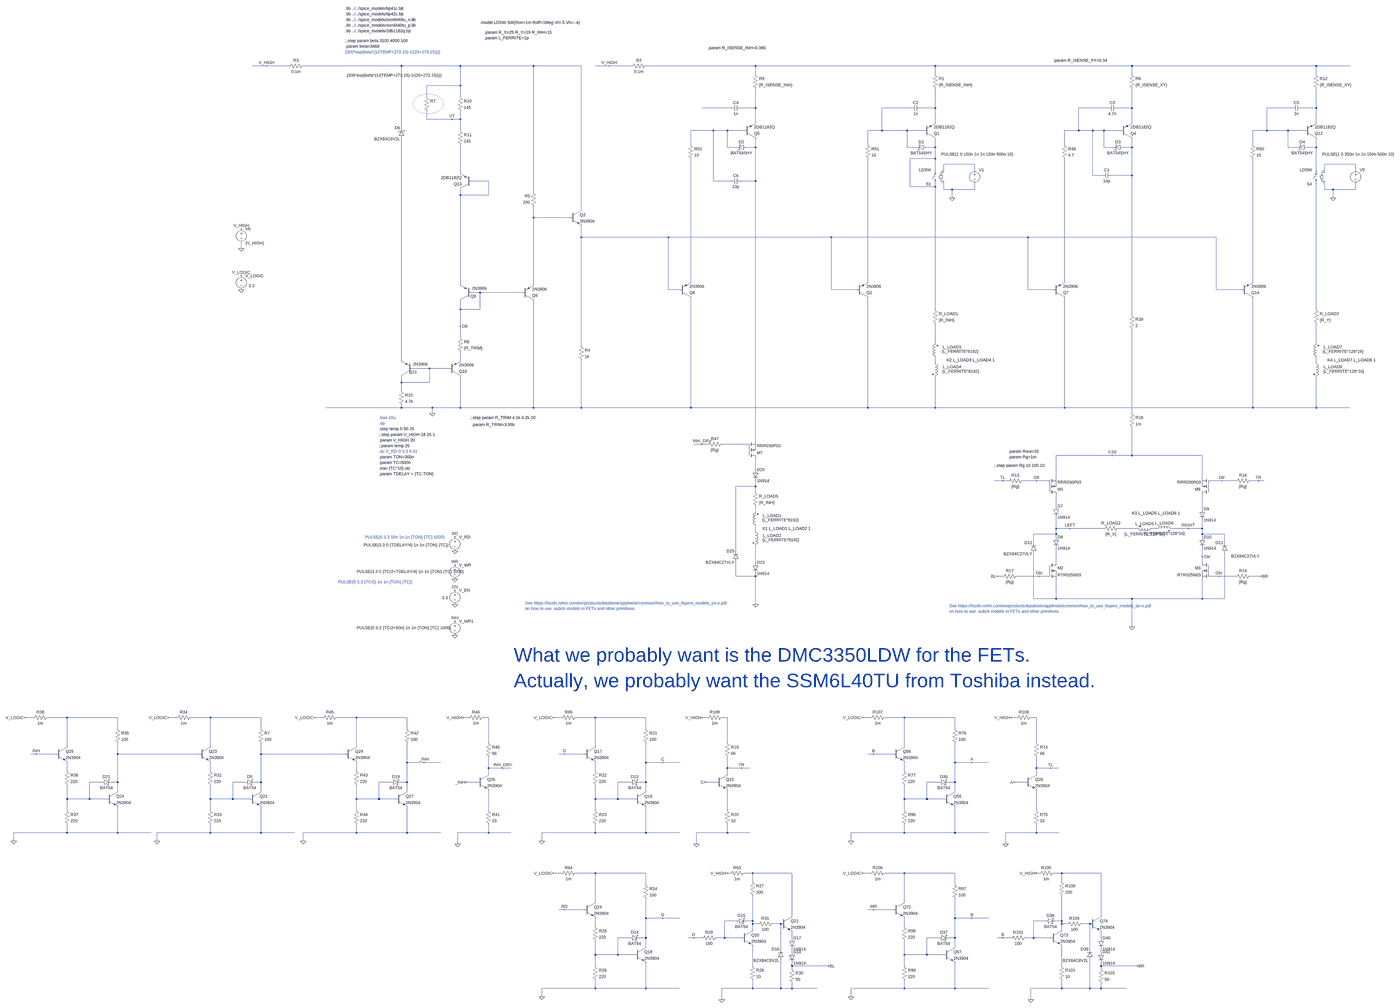
[diagram p0: schematic line_switch_new3.asc, whole sheet]
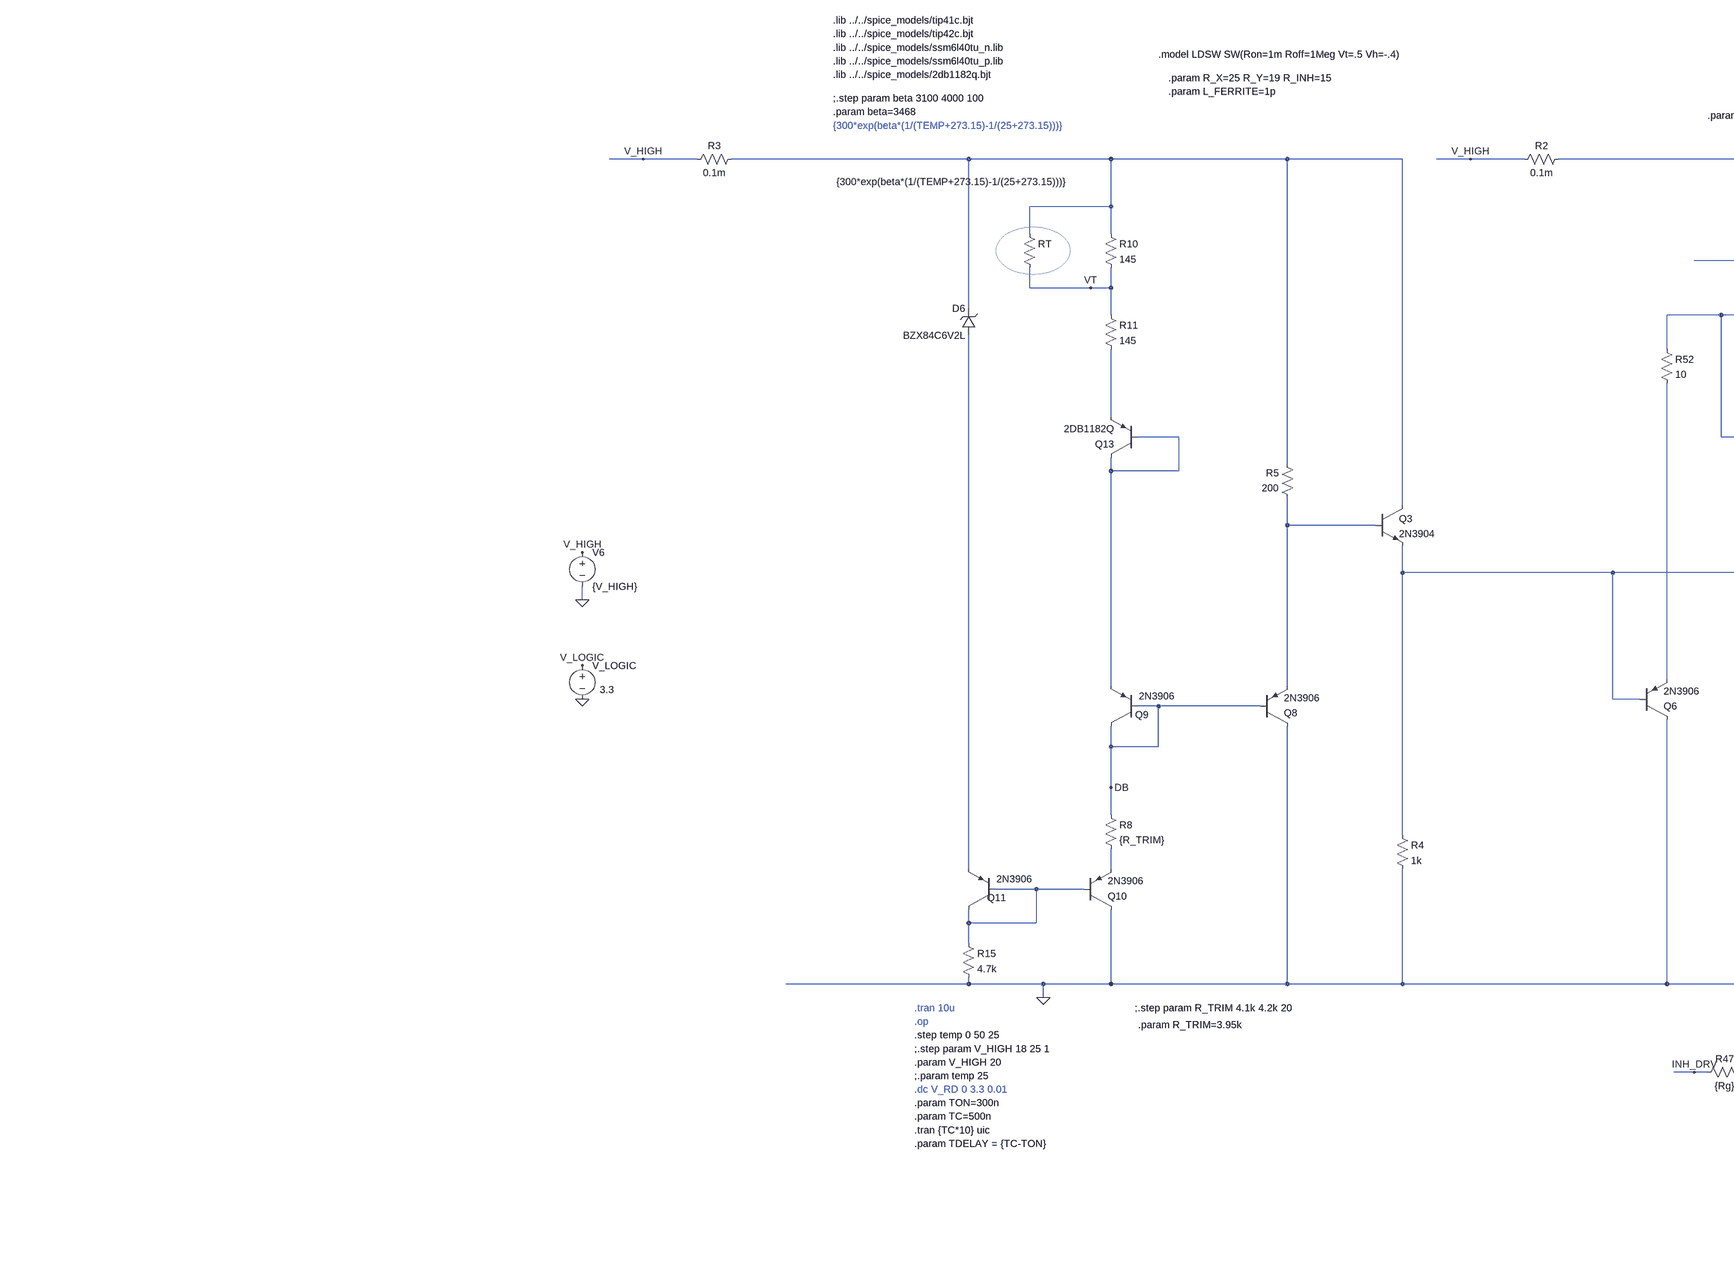
[diagram p1: schematic line_switch_new3.asc, part, row 1 of 2, column 1 of 2]
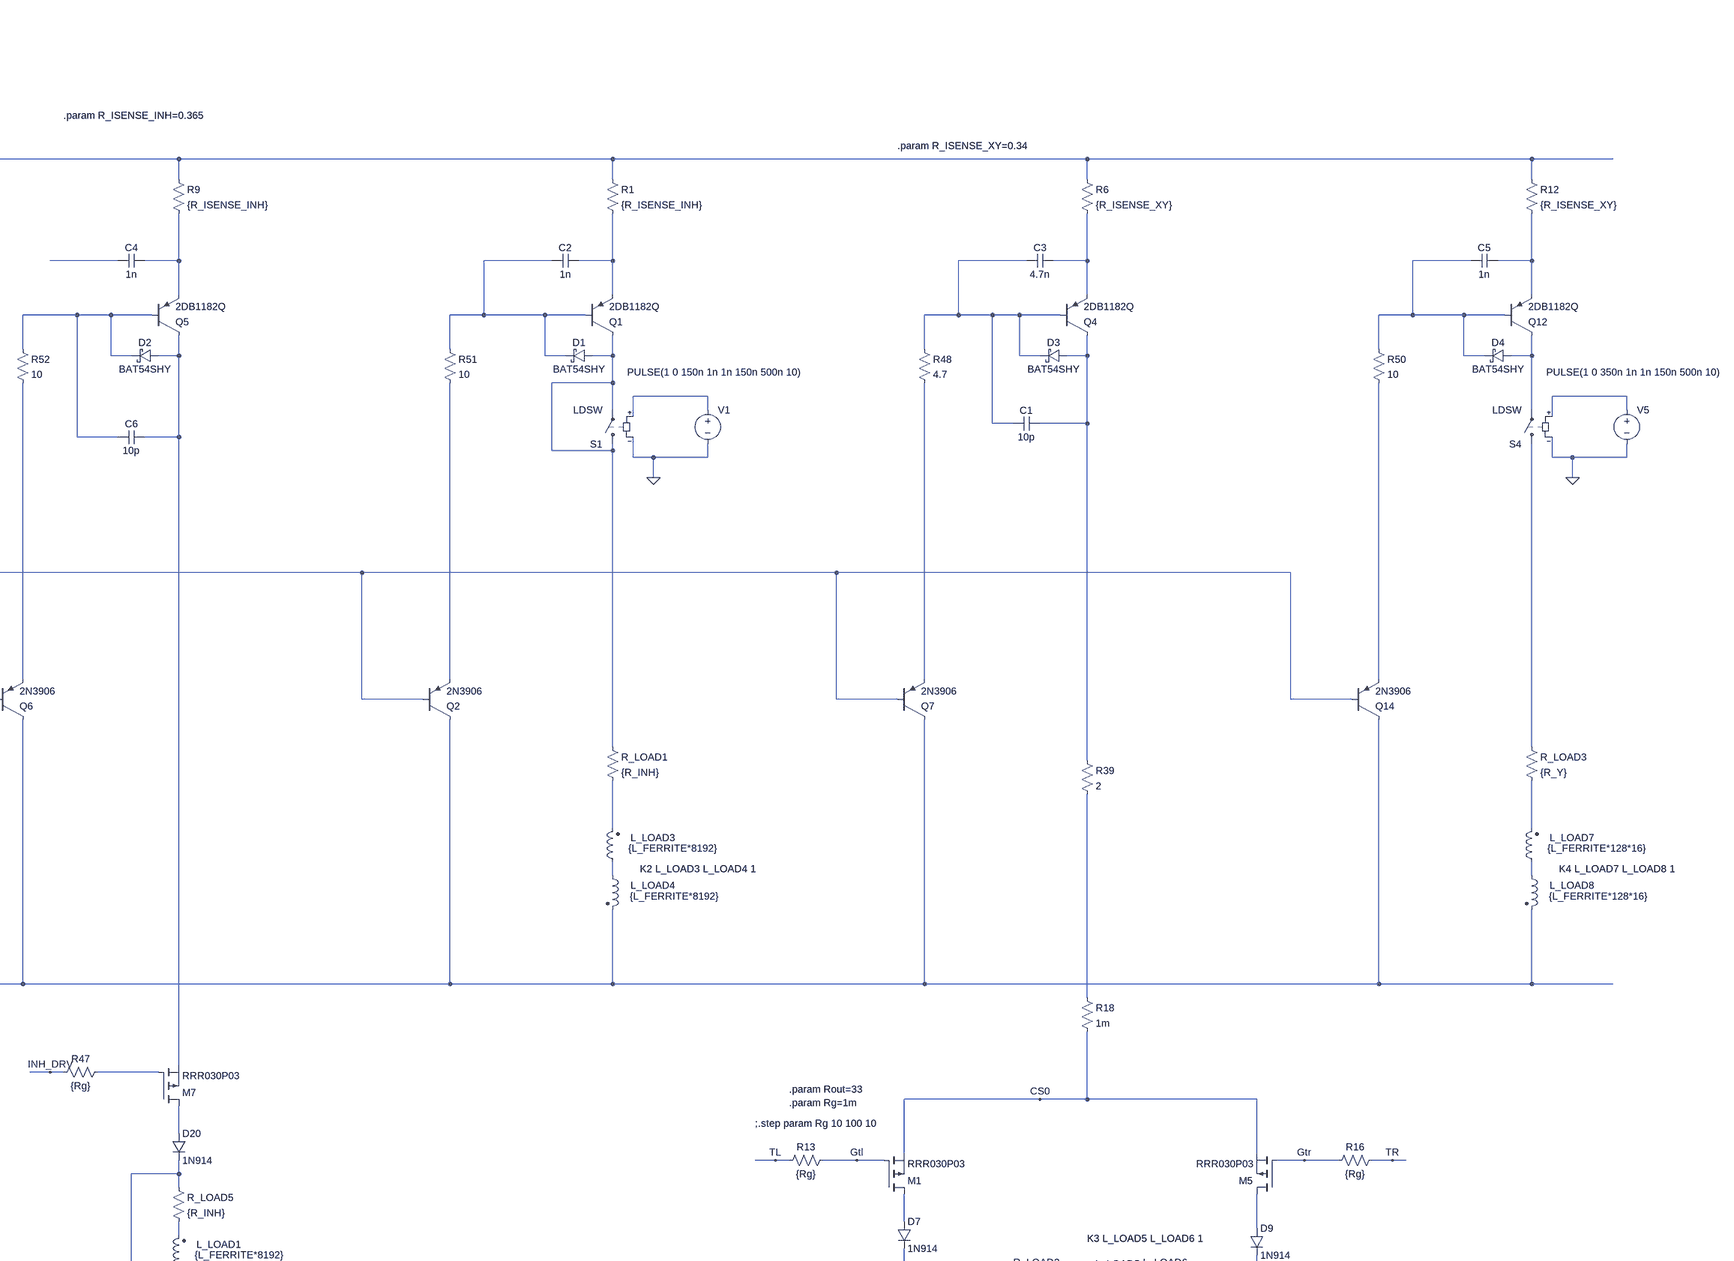
[diagram p2: schematic line_switch_new3.asc, part, row 1 of 2, column 2 of 2]
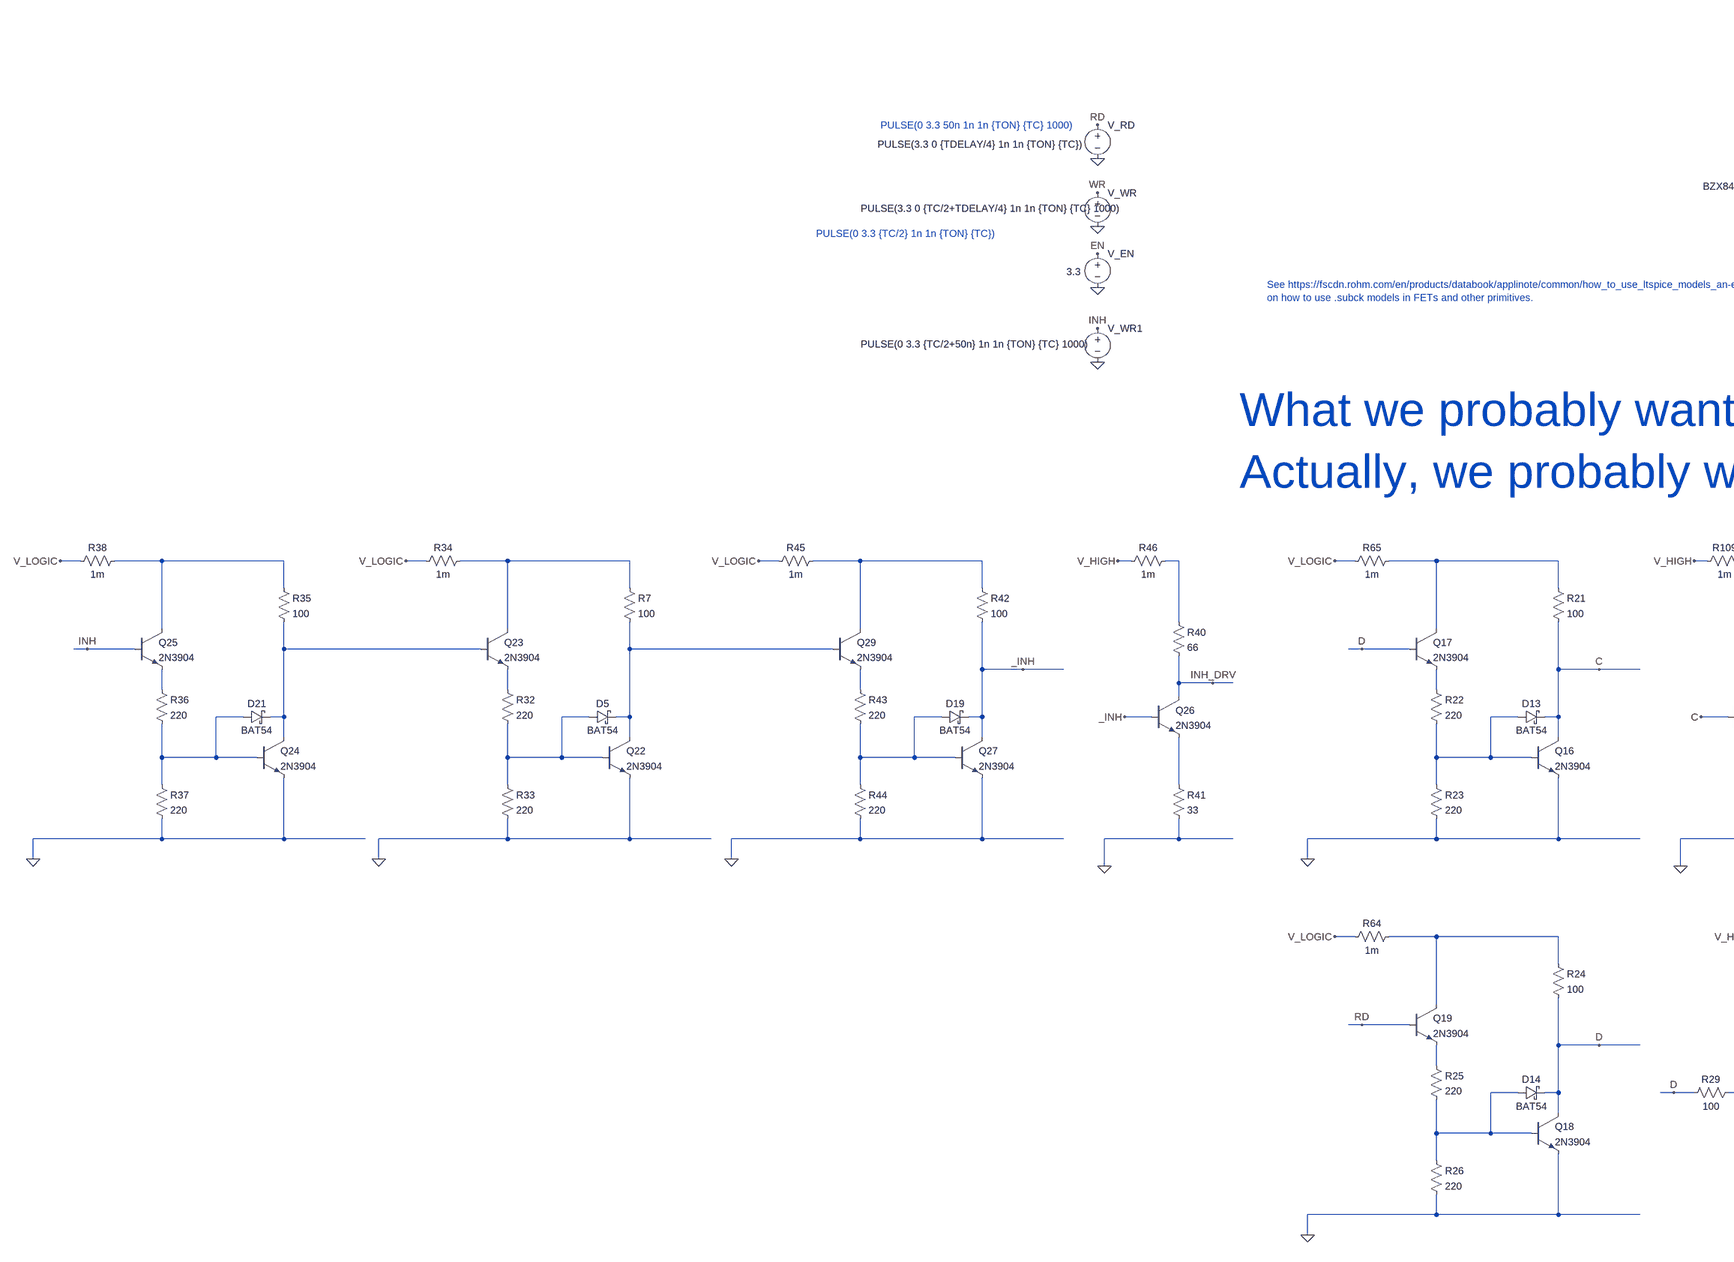
[diagram p3: schematic line_switch_new3.asc, part, row 2 of 2, column 1 of 2]
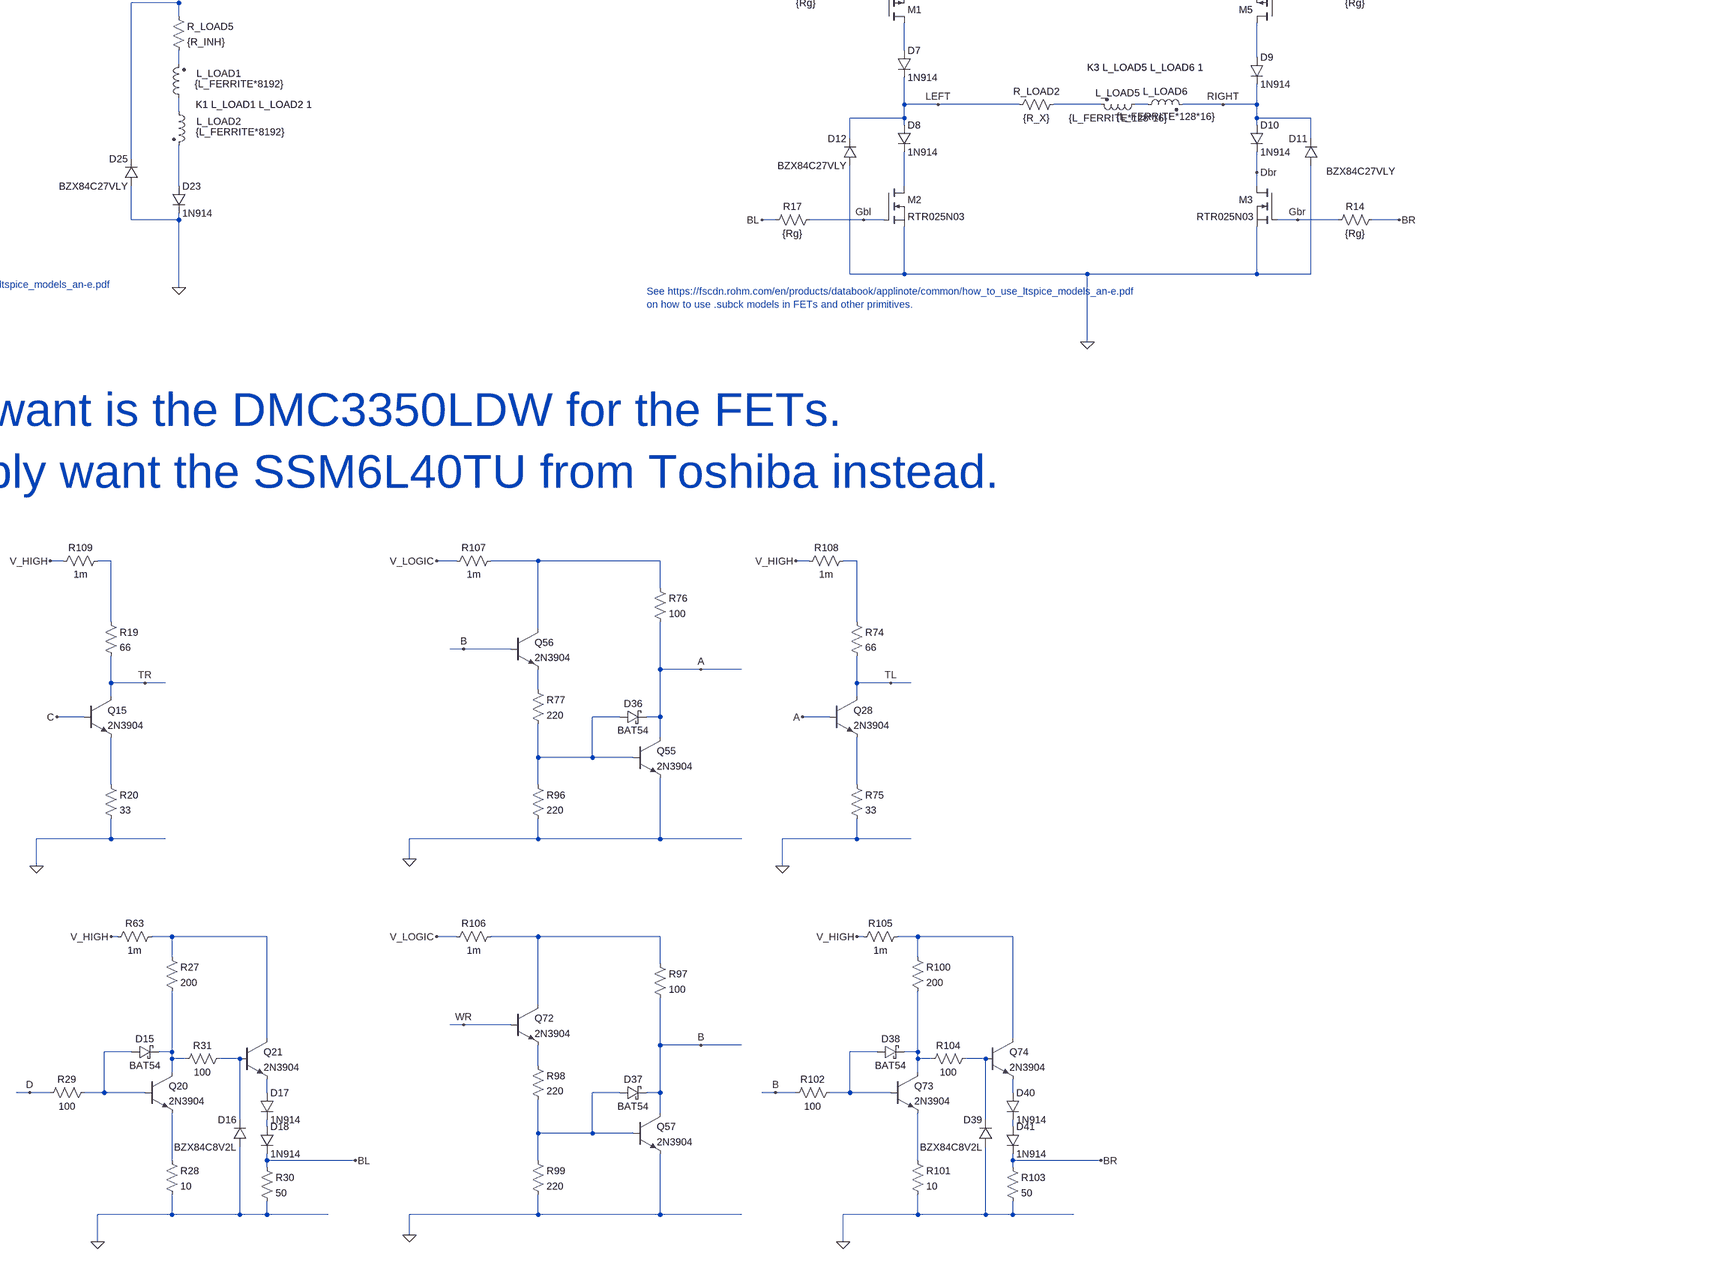
[diagram p4: schematic line_switch_new3.asc, part, row 2 of 2, column 2 of 2]
line_switch_new3.asc, the LTspice schematic file:
Version 4
SHEET 1 14296 5700
WIRE -1088 -3552 -1168 -3552
WIRE -960 -3552 -1088 -3552
WIRE -320 -3552 -880 -3552
WIRE 16 -3552 -320 -3552
WIRE 432 -3552 16 -3552
WIRE 704 -3552 432 -3552
WIRE 864 -3552 784 -3552
WIRE 992 -3552 864 -3552
WIRE 1696 -3552 1072 -3552
WIRE 2720 -3552 1696 -3552
WIRE 3840 -3552 2720 -3552
WIRE 4912 -3552 3840 -3552
WIRE 5104 -3552 4912 -3552
WIRE 1696 -3504 1696 -3552
WIRE 2720 -3504 2720 -3552
WIRE 3840 -3504 3840 -3552
WIRE 4912 -3504 4912 -3552
WIRE 16 -3440 16 -3552
WIRE 16 -3440 -176 -3440
WIRE -176 -3376 -176 -3440
WIRE 16 -3376 16 -3440
WIRE 1552 -3312 1392 -3312
WIRE 1696 -3312 1696 -3424
WIRE 1696 -3312 1616 -3312
WIRE 2576 -3312 2416 -3312
WIRE 2720 -3312 2720 -3424
WIRE 2720 -3312 2640 -3312
WIRE 3696 -3312 3536 -3312
WIRE 3840 -3312 3840 -3424
WIRE 3840 -3312 3760 -3312
WIRE 4768 -3312 4608 -3312
WIRE 4912 -3312 4912 -3424
WIRE 4912 -3312 4832 -3312
WIRE -176 -3248 -176 -3296
WIRE -32 -3248 -176 -3248
WIRE 16 -3248 16 -3296
WIRE 16 -3248 -32 -3248
WIRE 1696 -3232 1696 -3312
WIRE 2720 -3232 2720 -3312
WIRE 3840 -3232 3840 -3312
WIRE 4912 -3232 4912 -3312
WIRE -320 -3200 -320 -3552
WIRE 16 -3184 16 -3248
WIRE 1456 -3184 1328 -3184
WIRE 1536 -3184 1456 -3184
WIRE 1632 -3184 1536 -3184
WIRE 2416 -3184 2416 -3312
WIRE 2416 -3184 2336 -3184
WIRE 2560 -3184 2416 -3184
WIRE 2656 -3184 2560 -3184
WIRE 3536 -3184 3536 -3312
WIRE 3536 -3184 3456 -3184
WIRE 3616 -3184 3536 -3184
WIRE 3680 -3184 3616 -3184
WIRE 3776 -3184 3680 -3184
WIRE 4608 -3184 4608 -3312
WIRE 4608 -3184 4528 -3184
WIRE 4752 -3184 4608 -3184
WIRE 4848 -3184 4752 -3184
WIRE 1328 -3104 1328 -3184
WIRE 2336 -3104 2336 -3184
WIRE 3456 -3104 3456 -3184
WIRE 4528 -3104 4528 -3184
WIRE 1536 -3088 1536 -3184
WIRE 1584 -3088 1536 -3088
WIRE 1696 -3088 1696 -3136
WIRE 1696 -3088 1648 -3088
WIRE 2560 -3088 2560 -3184
WIRE 2608 -3088 2560 -3088
WIRE 2720 -3088 2720 -3136
WIRE 2720 -3088 2672 -3088
WIRE 3680 -3088 3680 -3184
WIRE 3728 -3088 3680 -3088
WIRE 3840 -3088 3840 -3136
WIRE 3840 -3088 3792 -3088
WIRE 4752 -3088 4752 -3184
WIRE 4800 -3088 4752 -3088
WIRE 4912 -3088 4912 -3136
WIRE 4912 -3088 4864 -3088
WIRE 2720 -3024 2720 -3088
WIRE 2720 -3024 2576 -3024
WIRE 2944 -2992 2768 -2992
WIRE 5136 -2992 4960 -2992
WIRE 2720 -2960 2720 -3024
WIRE 2944 -2960 2944 -2992
WIRE 4912 -2960 4912 -3088
WIRE 5136 -2960 5136 -2992
WIRE 16 -2944 16 -3104
WIRE 2768 -2944 2768 -2992
WIRE 4960 -2944 4960 -2992
WIRE 3616 -2928 3616 -3184
WIRE 3664 -2928 3616 -2928
WIRE 3840 -2928 3840 -3088
WIRE 3840 -2928 3728 -2928
WIRE 176 -2896 80 -2896
WIRE 1456 -2896 1456 -3184
WIRE 1552 -2896 1456 -2896
WIRE 1696 -2896 1696 -3088
WIRE 1696 -2896 1616 -2896
WIRE 2576 -2864 2576 -3024
WIRE 2720 -2864 2720 -2880
WIRE 2720 -2864 2576 -2864
WIRE 2768 -2848 2768 -2896
WIRE 2816 -2848 2768 -2848
WIRE 2944 -2848 2944 -2880
WIRE 2944 -2848 2816 -2848
WIRE 4960 -2848 4960 -2896
WIRE 5008 -2848 4960 -2848
WIRE 5136 -2848 5136 -2880
WIRE 5136 -2848 5008 -2848
WIRE 432 -2832 432 -3552
WIRE 16 -2816 16 -2848
WIRE 176 -2816 176 -2896
WIRE 176 -2816 16 -2816
WIRE 2816 -2800 2816 -2848
WIRE 5008 -2800 5008 -2848
WIRE 704 -2736 704 -3552
WIRE 432 -2688 432 -2752
WIRE 640 -2688 432 -2688
WIRE 704 -2576 704 -2640
WIRE 1200 -2576 704 -2576
WIRE 2128 -2576 1200 -2576
WIRE 3248 -2576 2128 -2576
WIRE 4320 -2576 3248 -2576
WIRE -1232 -2512 -1232 -2544
WIRE 1328 -2304 1328 -3024
WIRE 2336 -2304 2336 -3024
WIRE 3456 -2304 3456 -3024
WIRE 4528 -2304 4528 -3024
WIRE 16 -2288 16 -2816
WIRE 432 -2288 432 -2688
WIRE 1200 -2256 1200 -2576
WIRE 1264 -2256 1200 -2256
WIRE 2128 -2256 2128 -2576
WIRE 2272 -2256 2128 -2256
WIRE 3248 -2256 3248 -2576
WIRE 3392 -2256 3248 -2256
WIRE 4320 -2256 4320 -2576
WIRE 4464 -2256 4320 -2256
WIRE 128 -2240 80 -2240
WIRE 368 -2240 128 -2240
WIRE 16 -2144 16 -2192
WIRE 128 -2144 128 -2240
WIRE 128 -2144 16 -2144
WIRE 2720 -2144 2720 -2864
WIRE 4912 -2144 4912 -2880
WIRE 3840 -2112 3840 -2928
WIRE 16 -2048 16 -2144
WIRE 16 -1984 16 -2048
WIRE 2720 -1952 2720 -2064
WIRE 4912 -1952 4912 -2064
WIRE 704 -1936 704 -2576
WIRE -320 -1856 -320 -3136
WIRE 16 -1856 16 -1904
WIRE 2720 -1840 2720 -1872
WIRE 4912 -1840 4912 -1872
WIRE -160 -1808 -256 -1808
WIRE -48 -1808 -160 -1808
WIRE -320 -1728 -320 -1760
WIRE -160 -1728 -160 -1808
WIRE -160 -1728 -320 -1728
WIRE -320 -1680 -320 -1728
WIRE -320 -1584 -320 -1600
WIRE -320 -1584 -752 -1584
WIRE -144 -1584 -320 -1584
WIRE 16 -1584 16 -1760
WIRE 16 -1584 -144 -1584
WIRE 432 -1584 432 -2192
WIRE 432 -1584 16 -1584
WIRE 704 -1584 704 -1856
WIRE 704 -1584 432 -1584
WIRE 1328 -1584 1328 -2208
WIRE 1328 -1584 704 -1584
WIRE 2336 -1584 2336 -2208
WIRE 2336 -1584 1328 -1584
WIRE 2720 -1584 2720 -1760
WIRE 2720 -1584 2336 -1584
WIRE 3456 -1584 3456 -2208
WIRE 3456 -1584 2720 -1584
WIRE 4528 -1584 4528 -2208
WIRE 4528 -1584 3456 -1584
WIRE 4912 -1584 4912 -1760
WIRE 4912 -1584 4528 -1584
WIRE 5104 -1584 4912 -1584
WIRE -144 -1552 -144 -1584
WIRE 3840 -1552 3840 -2032
WIRE 1696 -1392 1696 -2896
WIRE 1392 -1376 1344 -1376
WIRE 1424 -1376 1392 -1376
WIRE 1648 -1376 1504 -1376
WIRE 3728 -1312 3408 -1312
WIRE 3840 -1312 3840 -1472
WIRE 3840 -1312 3728 -1312
WIRE 4240 -1312 3840 -1312
WIRE 1696 -1232 1696 -1296
WIRE 3408 -1184 3408 -1312
WIRE 4240 -1184 4240 -1312
WIRE 3104 -1168 3056 -1168
WIRE 3136 -1168 3104 -1168
WIRE 3296 -1168 3216 -1168
WIRE 3360 -1168 3296 -1168
WIRE 4352 -1168 4288 -1168
WIRE 4432 -1168 4352 -1168
WIRE 4560 -1168 4512 -1168
WIRE 4592 -1168 4560 -1168
WIRE 1696 -1136 1696 -1168
WIRE 1696 -1136 1584 -1136
WIRE 1696 -1104 1696 -1136
WIRE 3408 -1024 3408 -1088
WIRE 4240 -1008 4240 -1088
WIRE 1696 -992 1696 -1024
WIRE 3408 -896 3408 -960
WIRE 3488 -896 3408 -896
WIRE 3680 -896 3488 -896
WIRE 3872 -896 3760 -896
WIRE 3984 -896 3952 -896
WIRE 4160 -896 4064 -896
WIRE 4240 -896 4240 -944
WIRE 4240 -896 4160 -896
WIRE 1696 -880 1696 -912
WIRE 3408 -864 3408 -896
WIRE 3408 -864 3280 -864
WIRE 4240 -864 4240 -896
WIRE 4368 -864 4240 -864
WIRE 3408 -848 3408 -864
WIRE 4240 -848 4240 -864
WIRE 3280 -816 3280 -864
WIRE 4368 -816 4368 -864
WIRE 1584 -768 1584 -1136
WIRE 4240 -736 4240 -784
WIRE 1696 -704 1696 -800
WIRE 3408 -704 3408 -784
WIRE 4240 -704 4240 -736
WIRE 1584 -624 1584 -704
WIRE 1696 -624 1696 -640
WIRE 1696 -624 1584 -624
WIRE 3104 -624 3072 -624
WIRE 3312 -624 3184 -624
WIRE 3360 -624 3312 -624
WIRE 4336 -624 4288 -624
WIRE 4432 -624 4336 -624
WIRE 4576 -624 4512 -624
WIRE 3280 -496 3280 -752
WIRE 3408 -496 3408 -608
WIRE 3408 -496 3280 -496
WIRE 3840 -496 3408 -496
WIRE 4240 -496 4240 -608
WIRE 4240 -496 3840 -496
WIRE 4368 -496 4368 -752
WIRE 4368 -496 4240 -496
WIRE 1696 -464 1696 -624
WIRE 3840 -336 3840 -496
WIRE -2416 416 -2464 416
WIRE -2224 416 -2336 416
WIRE -1936 416 -2224 416
WIRE -1600 416 -1648 416
WIRE -1408 416 -1520 416
WIRE -1120 416 -1408 416
WIRE -768 416 -816 416
WIRE -576 416 -688 416
WIRE -288 416 -576 416
WIRE 64 416 32 416
WIRE 176 416 144 416
WIRE 592 416 544 416
WIRE 784 416 672 416
WIRE 1072 416 784 416
WIRE 1424 416 1392 416
WIRE 1536 416 1504 416
WIRE 2352 416 2304 416
WIRE 2544 416 2432 416
WIRE 2832 416 2544 416
WIRE 3184 416 3152 416
WIRE 3296 416 3264 416
WIRE -1936 480 -1936 416
WIRE -1120 480 -1120 416
WIRE -288 480 -288 416
WIRE 1072 480 1072 416
WIRE 2832 480 2832 416
WIRE 176 560 176 416
WIRE 1536 560 1536 416
WIRE 3296 560 3296 416
WIRE -2224 576 -2224 416
WIRE -1408 576 -1408 416
WIRE -576 576 -576 416
WIRE 784 576 784 416
WIRE 2544 576 2544 416
WIRE -2400 624 -2432 624
WIRE -2288 624 -2400 624
WIRE -1936 624 -1936 560
WIRE -1472 624 -1936 624
WIRE -1120 624 -1120 560
WIRE -640 624 -1120 624
WIRE 608 624 576 624
WIRE 720 624 608 624
WIRE 2368 624 2336 624
WIRE 2480 624 2368 624
WIRE -288 672 -288 560
WIRE -192 672 -288 672
WIRE -96 672 -192 672
WIRE 1072 672 1072 560
WIRE 1168 672 1072 672
WIRE 1264 672 1168 672
WIRE 2832 672 2832 560
WIRE 2928 672 2832 672
WIRE 3024 672 2928 672
WIRE 176 704 176 640
WIRE 256 704 176 704
WIRE 304 704 256 704
WIRE 1536 704 1536 640
WIRE 1616 704 1536 704
WIRE 1664 704 1616 704
WIRE 3296 704 3296 640
WIRE 3376 704 3296 704
WIRE 3424 704 3376 704
WIRE -2224 720 -2224 672
WIRE -1408 720 -1408 672
WIRE -576 720 -576 672
WIRE 784 720 784 672
WIRE 2544 720 2544 672
WIRE 176 736 176 704
WIRE 1536 736 1536 704
WIRE 3296 736 3296 704
WIRE -2032 784 -2096 784
WIRE -1936 784 -1936 624
WIRE -1936 784 -1968 784
WIRE -1216 784 -1280 784
WIRE -1120 784 -1120 624
WIRE -1120 784 -1152 784
WIRE -384 784 -448 784
WIRE -288 784 -288 672
WIRE -288 784 -320 784
WIRE 112 784 48 784
WIRE 976 784 912 784
WIRE 1072 784 1072 672
WIRE 1072 784 1040 784
WIRE 1472 784 1408 784
WIRE 2736 784 2672 784
WIRE 2832 784 2832 672
WIRE 2832 784 2800 784
WIRE 3232 784 3168 784
WIRE -1936 832 -1936 784
WIRE -1120 832 -1120 784
WIRE -288 832 -288 784
WIRE 1072 832 1072 784
WIRE 2832 832 2832 784
WIRE -2224 880 -2224 800
WIRE -2096 880 -2096 784
WIRE -2096 880 -2224 880
WIRE -2000 880 -2096 880
WIRE -1408 880 -1408 800
WIRE -1280 880 -1280 784
WIRE -1280 880 -1408 880
WIRE -1184 880 -1280 880
WIRE -576 880 -576 800
WIRE -448 880 -448 784
WIRE -448 880 -576 880
WIRE -352 880 -448 880
WIRE 784 880 784 800
WIRE 912 880 912 784
WIRE 912 880 784 880
WIRE 1008 880 912 880
WIRE 2544 880 2544 800
WIRE 2672 880 2672 784
WIRE 2672 880 2544 880
WIRE 2768 880 2672 880
WIRE -2224 944 -2224 880
WIRE -1408 944 -1408 880
WIRE -576 944 -576 880
WIRE 176 944 176 832
WIRE 784 944 784 880
WIRE 1536 944 1536 832
WIRE 2544 944 2544 880
WIRE 3296 944 3296 832
WIRE -2224 1072 -2224 1024
WIRE -2224 1072 -2528 1072
WIRE -1936 1072 -1936 928
WIRE -1936 1072 -2224 1072
WIRE -1744 1072 -1936 1072
WIRE -1408 1072 -1408 1024
WIRE -1408 1072 -1712 1072
WIRE -1120 1072 -1120 928
WIRE -1120 1072 -1408 1072
WIRE -928 1072 -1120 1072
WIRE -576 1072 -576 1024
WIRE -576 1072 -880 1072
WIRE -288 1072 -288 928
WIRE -288 1072 -576 1072
WIRE -96 1072 -288 1072
WIRE 176 1072 176 1024
WIRE 176 1072 0 1072
WIRE 304 1072 176 1072
WIRE 784 1072 784 1024
WIRE 784 1072 480 1072
WIRE 1072 1072 1072 928
WIRE 1072 1072 784 1072
WIRE 1264 1072 1072 1072
WIRE 1536 1072 1536 1024
WIRE 1536 1072 1360 1072
WIRE 1664 1072 1536 1072
WIRE 2544 1072 2544 1024
WIRE 2544 1072 2240 1072
WIRE 2832 1072 2832 928
WIRE 2832 1072 2544 1072
WIRE 3024 1072 2832 1072
WIRE 3296 1072 3296 1024
WIRE 3296 1072 3120 1072
WIRE 3424 1072 3296 1072
WIRE -2528 1120 -2528 1072
WIRE -1712 1120 -1712 1072
WIRE -880 1120 -880 1072
WIRE 480 1120 480 1072
WIRE 2240 1120 2240 1072
WIRE 0 1136 0 1072
WIRE 1360 1136 1360 1072
WIRE 3120 1136 3120 1072
WIRE 592 1568 544 1568
WIRE 784 1568 672 1568
WIRE 1072 1568 784 1568
WIRE 1552 1568 1536 1568
WIRE 1680 1568 1632 1568
WIRE 1904 1568 1680 1568
WIRE 2352 1568 2304 1568
WIRE 2544 1568 2432 1568
WIRE 2832 1568 2544 1568
WIRE 3312 1568 3296 1568
WIRE 3440 1568 3392 1568
WIRE 3664 1568 3440 1568
WIRE 1680 1616 1680 1568
WIRE 3440 1616 3440 1568
WIRE 1072 1632 1072 1568
WIRE 2832 1632 2832 1568
WIRE 784 1728 784 1568
WIRE 2544 1728 2544 1568
WIRE 608 1776 576 1776
WIRE 720 1776 608 1776
WIRE 2368 1776 2336 1776
WIRE 2480 1776 2368 1776
WIRE 1904 1808 1904 1568
WIRE 3664 1808 3664 1568
WIRE 1072 1824 1072 1712
WIRE 1168 1824 1072 1824
WIRE 1264 1824 1168 1824
WIRE 2832 1824 2832 1712
WIRE 2928 1824 2832 1824
WIRE 3024 1824 2928 1824
WIRE 1584 1840 1520 1840
WIRE 1680 1840 1680 1696
WIRE 1680 1840 1648 1840
WIRE 3344 1840 3280 1840
WIRE 3440 1840 3440 1696
WIRE 3440 1840 3408 1840
WIRE 1680 1856 1680 1840
WIRE 1712 1856 1680 1856
WIRE 1840 1856 1792 1856
WIRE 3440 1856 3440 1840
WIRE 3472 1856 3440 1856
WIRE 3600 1856 3552 1856
WIRE 784 1872 784 1824
WIRE 2544 1872 2544 1824
WIRE 1680 1888 1680 1856
WIRE 3440 1888 3440 1856
WIRE 976 1936 912 1936
WIRE 1072 1936 1072 1824
WIRE 1072 1936 1040 1936
WIRE 1344 1936 1312 1936
WIRE 1392 1936 1344 1936
WIRE 1520 1936 1520 1840
WIRE 1520 1936 1472 1936
WIRE 1616 1936 1520 1936
WIRE 1904 1936 1904 1904
WIRE 2736 1936 2672 1936
WIRE 2832 1936 2832 1824
WIRE 2832 1936 2800 1936
WIRE 3104 1936 3072 1936
WIRE 3152 1936 3104 1936
WIRE 3280 1936 3280 1840
WIRE 3280 1936 3232 1936
WIRE 3376 1936 3280 1936
WIRE 3664 1936 3664 1904
WIRE 1072 1984 1072 1936
WIRE 2832 1984 2832 1936
WIRE 1840 2000 1840 1856
WIRE 3600 2000 3600 1856
WIRE 1904 2016 1904 2000
WIRE 3664 2016 3664 2000
WIRE 784 2032 784 1952
WIRE 912 2032 912 1936
WIRE 912 2032 784 2032
WIRE 1008 2032 912 2032
WIRE 2544 2032 2544 1952
WIRE 2672 2032 2672 1936
WIRE 2672 2032 2544 2032
WIRE 2768 2032 2672 2032
WIRE 784 2096 784 2032
WIRE 1680 2096 1680 1984
WIRE 1904 2096 1904 2080
WIRE 2112 2096 1904 2096
WIRE 2544 2096 2544 2032
WIRE 3440 2096 3440 1984
WIRE 3664 2096 3664 2080
WIRE 3872 2096 3664 2096
WIRE 1904 2112 1904 2096
WIRE 3664 2112 3664 2096
WIRE 784 2224 784 2176
WIRE 784 2224 480 2224
WIRE 1072 2224 1072 2080
WIRE 1072 2224 784 2224
WIRE 1264 2224 1072 2224
WIRE 1680 2224 1680 2176
WIRE 1680 2224 1504 2224
WIRE 1840 2224 1840 2064
WIRE 1840 2224 1680 2224
WIRE 1904 2224 1904 2192
WIRE 1904 2224 1840 2224
WIRE 2048 2224 1904 2224
WIRE 2544 2224 2544 2176
WIRE 2544 2224 2240 2224
WIRE 2832 2224 2832 2080
WIRE 2832 2224 2544 2224
WIRE 3024 2224 2832 2224
WIRE 3440 2224 3440 2176
WIRE 3440 2224 3264 2224
WIRE 3600 2224 3600 2064
WIRE 3600 2224 3440 2224
WIRE 3664 2224 3664 2192
WIRE 3664 2224 3600 2224
WIRE 3808 2224 3664 2224
WIRE 480 2272 480 2224
WIRE 2240 2272 2240 2224
WIRE 1504 2288 1504 2224
WIRE 3264 2288 3264 2224
FLAG -144 -1552 0
FLAG -32 -3248 VT
FLAG 16 -2048 DB
FLAG 2816 -2800 0
FLAG 5008 -2800 0
FLAG 864 -3552 V_HIGH
FLAG -1088 -3552 V_HIGH
FLAG -1232 -2512 0
FLAG -1232 -2624 V_HIGH
FLAG 3840 -336 0
FLAG 3104 -1168 TL
FLAG 3488 -896 LEFT
FLAG 4160 -896 RIGHT
FLAG -16 -688 WR
FLAG -16 -608 0
FLAG -16 -848 RD
FLAG -16 -768 0
FLAG -16 -544 EN
FLAG -16 -464 0
FLAG -1232 -2336 V_LOGIC
FLAG -1232 -2256 0
FLAG 3296 -1168 Gtl
FLAG 3728 -1312 CS0
FLAG 4336 -624 Gbr
FLAG 4240 -736 Dbr
FLAG 3312 -624 Gbl
FLAG 4352 -1168 Gtr
FLAG 3072 -624 BL
FLAG 4560 -1168 TR
FLAG 4576 -624 BR
FLAG 3152 416 V_HIGH
FLAG 3120 1136 0
FLAG 2240 1120 0
FLAG 2928 672 A
FLAG 2368 624 B
FLAG 2304 416 V_LOGIC
FLAG 3168 784 A
FLAG 2240 2272 0
FLAG 2928 1824 B
FLAG 2368 1776 WR
FLAG 2304 1568 V_LOGIC
FLAG 3296 1568 V_HIGH
FLAG 3264 2288 0
FLAG 3104 1936 B
FLAG 3872 2096 BR
FLAG 3376 704 TL
FLAG 1392 416 V_HIGH
FLAG 1360 1136 0
FLAG 480 1120 0
FLAG 1168 672 C
FLAG 608 624 D
FLAG 544 416 V_LOGIC
FLAG 1408 784 C
FLAG 480 2272 0
FLAG 1168 1824 D
FLAG 608 1776 RD
FLAG 544 1568 V_LOGIC
FLAG 1536 1568 V_HIGH
FLAG 1504 2288 0
FLAG 1344 1936 D
FLAG 2112 2096 BL
FLAG 1616 704 TR
FLAG -16 -368 INH
FLAG -16 -288 0
FLAG 32 416 V_HIGH
FLAG 0 1136 0
FLAG -880 1120 0
FLAG -192 672 _INH
FLAG -816 416 V_LOGIC
FLAG 48 784 _INH
FLAG 256 704 INH_DRV
FLAG 1696 -464 0
FLAG 1392 -1376 INH_DRV
FLAG -1712 1120 0
FLAG -1648 416 V_LOGIC
FLAG -2528 1120 0
FLAG -2400 624 INH
FLAG -2464 416 V_LOGIC
SYMBOL res 0 -2000 R0
SYMATTR InstName R8
SYMATTR Value {R_TRIM}
SYMBOL res 1680 -3520 R0
SYMATTR InstName R9
SYMATTR Value {R_ISENSE_INH}
SYMBOL pnp 1632 -3136 M180
SYMATTR InstName Q5
SYMATTR Value 2DB1182Q
SYMBOL pnp 368 -2192 M180
SYMATTR InstName Q8
SYMATTR Value 2N3906
SYMBOL pnp 80 -2192 R180
WINDOW 0 -25 28 Left 2
WINDOW 3 -86 72 Left 2
SYMATTR InstName Q9
SYMATTR Value 2N3906
SYMBOL res 0 -3392 R0
SYMATTR InstName R10
SYMATTR Value 145
SYMBOL res 0 -3200 R0
SYMATTR InstName R11
SYMATTR Value 145
SYMBOL res -192 -3392 R0
WINDOW 3 -440 -107 Left 2
SYMATTR Value {300*exp(beta*(1/(TEMP+273.15)-1/(25+273.15)))}
SYMATTR InstName RT
SYMBOL schottky 1648 -3104 R90
WINDOW 0 0 32 VBottom 2
WINDOW 3 32 32 VTop 2
SYMATTR InstName D2
SYMATTR Value BAT54SHY
SYMATTR Description Diode
SYMATTR Type diode
SYMBOL zener -304 -3136 R180
WINDOW 0 24 64 Left 2
WINDOW 3 24 0 Left 2
SYMATTR InstName D6
SYMATTR Value BZX84C6V2L
SYMBOL res -336 -1696 R0
SYMATTR InstName R15
SYMATTR Value 4.7k
SYMBOL pnp -48 -1760 M180
SYMATTR InstName Q10
SYMATTR Value 2N3906
SYMBOL pnp -256 -1760 R180
WINDOW 0 -25 28 Left 2
WINDOW 3 -86 72 Left 2
SYMATTR InstName Q11
SYMATTR Value 2N3906
SYMBOL res 2704 -3520 R0
SYMATTR InstName R1
SYMATTR Value {R_ISENSE_INH}
SYMBOL pnp 2656 -3136 M180
SYMATTR InstName Q1
SYMATTR Value 2DB1182Q
SYMBOL pnp 2272 -2208 M180
SYMATTR InstName Q2
SYMATTR Value 2N3906
SYMBOL schottky 2672 -3104 R90
WINDOW 0 0 32 VBottom 2
WINDOW 3 32 32 VTop 2
SYMATTR InstName D1
SYMATTR Value BAT54SHY
SYMATTR Description Diode
SYMATTR Type diode
SYMBOL sw 2720 -2864 R180
SYMATTR InstName S1
SYMATTR Value LDSW
SYMBOL voltage 2944 -2976 R0
WINDOW 123 0 0 Left 0
WINDOW 39 0 0 Left 0
WINDOW 3 -190 -74 Left 2
SYMATTR Value PULSE(1 0 150n 1n 1n 150n 500n 10)
SYMATTR InstName V1
SYMBOL res 2704 -2160 R0
SYMATTR InstName R_LOAD1
SYMATTR Value {R_INH}
SYMBOL ind2 2736 -1856 R180
WINDOW 0 -26 74 Right 2
WINDOW 3 -21 49 Right 2
SYMATTR InstName L_LOAD3
SYMATTR Value {L_FERRITE*8192}
SYMATTR Type ind
SYMBOL ind2 2704 -1856 R0
WINDOW 0 58 39 Left 2
WINDOW 3 56 64 Left 2
SYMATTR InstName L_LOAD4
SYMATTR Value {L_FERRITE*8192}
SYMATTR Type ind
SYMBOL npn 640 -2736 R0
SYMATTR InstName Q3
SYMATTR Value 2N3904
SYMBOL pnp 1264 -2208 M180
SYMATTR InstName Q6
SYMATTR Value 2N3906
SYMBOL res 688 -1952 R0
SYMATTR InstName R4
SYMATTR Value 1k
SYMBOL pnp 80 -2848 R180
SYMATTR InstName Q13
SYMATTR Value 2DB1182Q
SYMBOL res 448 -2736 R180
WINDOW 0 36 76 Left 2
WINDOW 3 36 40 Left 2
SYMATTR InstName R5
SYMATTR Value 200
SYMBOL res 3824 -3520 R0
SYMATTR InstName R6
SYMATTR Value {R_ISENSE_XY}
SYMBOL pnp 3776 -3136 M180
SYMATTR InstName Q4
SYMATTR Value 2DB1182Q
SYMBOL pnp 3392 -2208 M180
SYMATTR InstName Q7
SYMATTR Value 2N3906
SYMBOL schottky 3792 -3104 R90
WINDOW 0 0 32 VBottom 2
WINDOW 3 32 32 VTop 2
SYMATTR InstName D3
SYMATTR Value BAT54SHY
SYMATTR Description Diode
SYMATTR Type diode
SYMBOL res 3664 -880 R270
WINDOW 0 32 56 VTop 2
WINDOW 3 0 56 VBottom 2
SYMATTR InstName R_LOAD2
SYMATTR Value {R_X}
SYMBOL ind2 3968 -912 R90
WINDOW 0 4 56 VBottom 2
WINDOW 3 32 56 VTop 2
SYMATTR InstName L_LOAD5
SYMATTR Value {L_FERRITE*128*16}
SYMATTR Type ind
SYMBOL ind2 3968 -880 R270
WINDOW 0 32 56 VTop 2
WINDOW 3 4 56 VBottom 2
SYMATTR InstName L_LOAD6
SYMATTR Value {L_FERRITE*128*16}
SYMATTR Type ind
SYMBOL res 4896 -3520 R0
SYMATTR InstName R12
SYMATTR Value {R_ISENSE_XY}
SYMBOL pnp 4848 -3136 M180
SYMATTR InstName Q12
SYMATTR Value 2DB1182Q
SYMBOL pnp 4464 -2208 M180
SYMATTR InstName Q14
SYMATTR Value 2N3906
SYMBOL schottky 4864 -3104 R90
WINDOW 0 0 32 VBottom 2
WINDOW 3 32 32 VTop 2
SYMATTR InstName D4
SYMATTR Value BAT54SHY
SYMATTR Description Diode
SYMATTR Type diode
SYMBOL sw 4912 -2864 R180
SYMATTR InstName S4
SYMATTR Value LDSW
SYMBOL voltage 5136 -2976 R0
WINDOW 123 0 0 Left 0
WINDOW 39 0 0 Left 0
WINDOW 3 -190 -74 Left 2
SYMATTR Value PULSE(1 0 350n 1n 1n 150n 500n 10)
SYMATTR InstName V5
SYMBOL res 4896 -2160 R0
SYMATTR InstName R_LOAD3
SYMATTR Value {R_Y}
SYMBOL ind2 4928 -1856 R180
WINDOW 0 -26 74 Right 2
WINDOW 3 -21 49 Right 2
SYMATTR InstName L_LOAD7
SYMATTR Value {L_FERRITE*128*16}
SYMATTR Type ind
SYMBOL ind2 4896 -1856 R0
WINDOW 0 58 39 Left 2
WINDOW 3 56 64 Left 2
SYMATTR InstName L_LOAD8
SYMATTR Value {L_FERRITE*128*16}
SYMATTR Type ind
SYMBOL res 976 -3536 R270
WINDOW 0 32 56 VTop 2
WINDOW 3 0 56 VBottom 2
SYMATTR InstName R2
SYMATTR Value 0.1m
SYMBOL res -976 -3536 R270
WINDOW 0 32 56 VTop 2
WINDOW 3 0 56 VBottom 2
SYMATTR InstName R3
SYMATTR Value 0.1m
SYMBOL voltage -1232 -2640 R0
SYMATTR InstName V6
SYMATTR Value {V_HIGH}
SYMBOL diode 3392 -1024 R0
SYMATTR InstName D7
SYMATTR Value 1N914
SYMBOL diode 3392 -848 R0
SYMATTR InstName D8
SYMATTR Value 1N914
SYMBOL diode 4224 -1008 R0
SYMATTR InstName D9
SYMATTR Value 1N914
SYMBOL diode 4224 -848 R0
SYMATTR InstName D10
SYMATTR Value 1N914
SYMBOL diode 4384 -752 R180
WINDOW 0 24 64 Left 2
WINDOW 3 -183 -13 Left 2
SYMATTR InstName D11
SYMATTR Value BZX84C27VLY
SYMBOL diode 3296 -752 R180
WINDOW 0 24 64 Left 2
WINDOW 3 24 0 Left 2
SYMATTR InstName D12
SYMATTR Value BZX84C27VLY
SYMBOL voltage -16 -704 R0
WINDOW 123 0 0 Left 0
WINDOW 39 0 0 Left 0
WINDOW 3 -559 53 Left 2
SYMATTR Value PULSE(3.3 0 {TC/2+TDELAY/4} 1n 1n {TON} {TC} 1000)
SYMATTR InstName V_WR
SYMBOL voltage -16 -864 R0
WINDOW 123 0 0 Left 0
WINDOW 39 0 0 Left 0
WINDOW 3 -519 61 Left 2
SYMATTR Value PULSE(3.3 0 {TDELAY/4} 1n 1n {TON} {TC})
SYMATTR InstName V_RD
SYMBOL voltage -16 -560 R0
WINDOW 123 0 0 Left 0
WINDOW 39 0 0 Left 0
WINDOW 3 -73 58 Left 2
SYMATTR Value 3.3
SYMATTR InstName V_EN
SYMBOL voltage -1232 -2352 R0
WINDOW 123 0 0 Left 0
WINDOW 39 0 0 Left 0
WINDOW 3 42 73 Left 2
SYMATTR Value 3.3
SYMATTR InstName V_LOGIC
SYMBOL res 3232 -1184 R90
WINDOW 0 0 56 VBottom 2
WINDOW 3 32 56 VTop 2
SYMATTR InstName R13
SYMATTR Value {Rg}
SYMBOL res 4528 -640 R90
WINDOW 0 0 56 VBottom 2
WINDOW 3 32 56 VTop 2
SYMATTR InstName R14
SYMATTR Value {Rg}
SYMBOL res 4528 -1184 R90
WINDOW 0 0 56 VBottom 2
WINDOW 3 32 56 VTop 2
SYMATTR InstName R16
SYMATTR Value {Rg}
SYMBOL res 3200 -640 R90
WINDOW 0 0 56 VBottom 2
WINDOW 3 32 56 VTop 2
SYMATTR InstName R17
SYMATTR Value {Rg}
SYMBOL res 3824 -1568 R0
SYMATTR InstName R18
SYMATTR Value 1m
SYMBOL npn 3232 736 R0
SYMATTR InstName Q28
SYMATTR Value 2N3904
SYMBOL res 3280 544 R0
SYMATTR InstName R74
SYMATTR Value 66
SYMBOL res 3280 928 R0
SYMATTR InstName R75
SYMATTR Value 33
SYMBOL npn 2768 832 R0
SYMATTR InstName Q55
SYMATTR Value 2N3904
SYMBOL schottky 2736 800 R270
WINDOW 0 32 32 VTop 2
WINDOW 3 0 32 VBottom 2
SYMATTR InstName D36
SYMATTR Value BAT54
SYMATTR Description Diode
SYMATTR Type diode
SYMBOL npn 2480 576 R0
SYMATTR InstName Q56
SYMATTR Value 2N3904
SYMBOL res 2816 464 R0
SYMATTR InstName R76
SYMATTR Value 100
SYMBOL res 2528 704 R0
SYMATTR InstName R77
SYMATTR Value 220
SYMBOL res 2528 928 R0
SYMATTR InstName R96
SYMATTR Value 220
SYMBOL npn 2768 1984 R0
SYMATTR InstName Q57
SYMATTR Value 2N3904
SYMBOL schottky 2736 1952 R270
WINDOW 0 32 32 VTop 2
WINDOW 3 0 32 VBottom 2
SYMATTR InstName D37
SYMATTR Value BAT54
SYMATTR Description Diode
SYMATTR Type diode
SYMBOL npn 2480 1728 R0
SYMATTR InstName Q72
SYMATTR Value 2N3904
SYMBOL res 2816 1616 R0
SYMATTR InstName R97
SYMATTR Value 100
SYMBOL res 2528 1856 R0
SYMATTR InstName R98
SYMATTR Value 220
SYMBOL res 2528 2080 R0
SYMATTR InstName R99
SYMATTR Value 220
SYMBOL res 3424 1600 R0
SYMATTR InstName R100
SYMATTR Value 200
SYMBOL res 3424 2080 R0
SYMATTR InstName R101
SYMATTR Value 10
SYMBOL res 3248 1920 R90
WINDOW 0 0 56 VBottom 2
WINDOW 3 32 56 VTop 2
SYMATTR InstName R102
SYMATTR Value 100
SYMBOL npn 3376 1888 R0
SYMATTR InstName Q73
SYMATTR Value 2N3904
SYMBOL schottky 3344 1856 R270
WINDOW 0 32 32 VTop 2
WINDOW 3 0 32 VBottom 2
SYMATTR InstName D38
SYMATTR Value BAT54
SYMATTR Description Diode
SYMATTR Type diode
SYMBOL diode 3616 2064 R180
WINDOW 0 24 64 Left 2
WINDOW 3 24 0 Left 2
SYMATTR InstName D39
SYMATTR Value BZX84C8V2L
SYMBOL res 3648 2096 R0
SYMATTR InstName R103
SYMATTR Value 50
SYMBOL npn 3600 1808 R0
SYMATTR InstName Q74
SYMATTR Value 2N3904
SYMBOL res 3568 1840 R90
WINDOW 0 0 56 VBottom 2
WINDOW 3 32 56 VTop 2
SYMATTR InstName R104
SYMATTR Value 100
SYMBOL diode 3648 1936 R0
SYMATTR InstName D40
SYMATTR Value 1N914
SYMBOL diode 3648 2016 R0
SYMATTR InstName D41
SYMATTR Value 1N914
SYMBOL res 3296 1584 R270
WINDOW 0 32 56 VTop 2
WINDOW 3 0 56 VBottom 2
SYMATTR InstName R105
SYMATTR Value 1m
SYMBOL res 2336 1584 R270
WINDOW 0 32 56 VTop 2
WINDOW 3 0 56 VBottom 2
SYMATTR InstName R106
SYMATTR Value 1m
SYMBOL res 2336 432 R270
WINDOW 0 32 56 VTop 2
WINDOW 3 0 56 VBottom 2
SYMATTR InstName R107
SYMATTR Value 1m
SYMBOL res 3168 432 R270
WINDOW 0 32 56 VTop 2
WINDOW 3 0 56 VBottom 2
SYMATTR InstName R108
SYMATTR Value 1m
SYMBOL npn 1472 736 R0
SYMATTR InstName Q15
SYMATTR Value 2N3904
SYMBOL res 1520 544 R0
SYMATTR InstName R19
SYMATTR Value 66
SYMBOL res 1520 928 R0
SYMATTR InstName R20
SYMATTR Value 33
SYMBOL npn 1008 832 R0
SYMATTR InstName Q16
SYMATTR Value 2N3904
SYMBOL schottky 976 800 R270
WINDOW 0 32 32 VTop 2
WINDOW 3 0 32 VBottom 2
SYMATTR InstName D13
SYMATTR Value BAT54
SYMATTR Description Diode
SYMATTR Type diode
SYMBOL npn 720 576 R0
SYMATTR InstName Q17
SYMATTR Value 2N3904
SYMBOL res 1056 464 R0
SYMATTR InstName R21
SYMATTR Value 100
SYMBOL res 768 704 R0
SYMATTR InstName R22
SYMATTR Value 220
SYMBOL res 768 928 R0
SYMATTR InstName R23
SYMATTR Value 220
SYMBOL npn 1008 1984 R0
SYMATTR InstName Q18
SYMATTR Value 2N3904
SYMBOL schottky 976 1952 R270
WINDOW 0 32 32 VTop 2
WINDOW 3 0 32 VBottom 2
SYMATTR InstName D14
SYMATTR Value BAT54
SYMATTR Description Diode
SYMATTR Type diode
SYMBOL npn 720 1728 R0
SYMATTR InstName Q19
SYMATTR Value 2N3904
SYMBOL res 1056 1616 R0
SYMATTR InstName R24
SYMATTR Value 100
SYMBOL res 768 1856 R0
SYMATTR InstName R25
SYMATTR Value 220
SYMBOL res 768 2080 R0
SYMATTR InstName R26
SYMATTR Value 220
SYMBOL res 1664 1600 R0
SYMATTR InstName R27
SYMATTR Value 200
SYMBOL res 1664 2080 R0
SYMATTR InstName R28
SYMATTR Value 10
SYMBOL res 1488 1920 R90
WINDOW 0 0 56 VBottom 2
WINDOW 3 32 56 VTop 2
SYMATTR InstName R29
SYMATTR Value 100
SYMBOL npn 1616 1888 R0
SYMATTR InstName Q20
SYMATTR Value 2N3904
SYMBOL schottky 1584 1856 R270
WINDOW 0 32 32 VTop 2
WINDOW 3 0 32 VBottom 2
SYMATTR InstName D15
SYMATTR Value BAT54
SYMATTR Description Diode
SYMATTR Type diode
SYMBOL diode 1856 2064 R180
WINDOW 0 24 64 Left 2
WINDOW 3 24 0 Left 2
SYMATTR InstName D16
SYMATTR Value BZX84C8V2L
SYMBOL res 1888 2096 R0
SYMATTR InstName R30
SYMATTR Value 50
SYMBOL npn 1840 1808 R0
SYMATTR InstName Q21
SYMATTR Value 2N3904
SYMBOL res 1808 1840 R90
WINDOW 0 0 56 VBottom 2
WINDOW 3 32 56 VTop 2
SYMATTR InstName R31
SYMATTR Value 100
SYMBOL diode 1888 1936 R0
SYMATTR InstName D17
SYMATTR Value 1N914
SYMBOL diode 1888 2016 R0
SYMATTR InstName D18
SYMATTR Value 1N914
SYMBOL res 1536 1584 R270
WINDOW 0 32 56 VTop 2
WINDOW 3 0 56 VBottom 2
SYMATTR InstName R63
SYMATTR Value 1m
SYMBOL res 576 1584 R270
WINDOW 0 32 56 VTop 2
WINDOW 3 0 56 VBottom 2
SYMATTR InstName R64
SYMATTR Value 1m
SYMBOL res 576 432 R270
WINDOW 0 32 56 VTop 2
WINDOW 3 0 56 VBottom 2
SYMATTR InstName R65
SYMATTR Value 1m
SYMBOL res 1408 432 R270
WINDOW 0 32 56 VTop 2
WINDOW 3 0 56 VBottom 2
SYMATTR InstName R109
SYMATTR Value 1m
SYMBOL res 1680 -1120 R0
SYMATTR InstName R_LOAD5
SYMATTR Value {R_INH}
SYMBOL ind2 1712 -896 R180
WINDOW 0 -26 74 Right 2
WINDOW 3 -21 49 Right 2
SYMATTR InstName L_LOAD1
SYMATTR Value {L_FERRITE*8192}
SYMATTR Type ind
SYMBOL ind2 1680 -896 R0
WINDOW 0 58 39 Left 2
WINDOW 3 56 64 Left 2
SYMATTR InstName L_LOAD2
SYMATTR Value {L_FERRITE*8192}
SYMATTR Type ind
SYMBOL pmos 4288 -1088 R180
SYMATTR InstName M5
SYMATTR Value RRR030P03
SYMBOL pmos 3360 -1088 M180
SYMATTR InstName M1
SYMATTR Value RRR030P03
SYMBOL nmos 3360 -704 R0
SYMATTR InstName M2
SYMATTR Value RTR025N03
SYMBOL nmos 4288 -704 M0
SYMATTR InstName M3
SYMATTR Value RTR025N03
SYMBOL voltage -16 -384 R0
WINDOW 123 0 0 Left 0
WINDOW 39 0 0 Left 0
WINDOW 3 -559 53 Left 2
SYMATTR Value PULSE(0 3.3 {TC/2+50n} 1n 1n {TON} {TC} 1000)
SYMATTR InstName V_WR1
SYMBOL npn 112 736 R0
SYMATTR InstName Q26
SYMATTR Value 2N3904
SYMBOL res 160 544 R0
SYMATTR InstName R40
SYMATTR Value 66
SYMBOL res 160 928 R0
SYMATTR InstName R41
SYMATTR Value 33
SYMBOL npn -352 832 R0
SYMATTR InstName Q27
SYMATTR Value 2N3904
SYMBOL schottky -384 800 R270
WINDOW 0 32 32 VTop 2
WINDOW 3 0 32 VBottom 2
SYMATTR InstName D19
SYMATTR Value BAT54
SYMATTR Description Diode
SYMATTR Type diode
SYMBOL npn -640 576 R0
SYMATTR InstName Q29
SYMATTR Value 2N3904
SYMBOL res -304 464 R0
SYMATTR InstName R42
SYMATTR Value 100
SYMBOL res -592 704 R0
SYMATTR InstName R43
SYMATTR Value 220
SYMBOL res -592 928 R0
SYMATTR InstName R44
SYMATTR Value 220
SYMBOL res -784 432 R270
WINDOW 0 32 56 VTop 2
WINDOW 3 0 56 VBottom 2
SYMATTR InstName R45
SYMATTR Value 1m
SYMBOL res 48 432 R270
WINDOW 0 32 56 VTop 2
WINDOW 3 0 56 VBottom 2
SYMATTR InstName R46
SYMATTR Value 1m
SYMBOL diode 1680 -1232 R0
SYMATTR InstName D20
SYMATTR Value 1N914
SYMBOL diode 1680 -704 R0
SYMATTR InstName D23
SYMATTR Value 1N914
SYMBOL diode 1600 -704 R180
WINDOW 0 24 64 Left 2
WINDOW 3 24 0 Left 2
SYMATTR InstName D25
SYMATTR Value BZX84C27VLY
SYMBOL res 1520 -1392 R90
WINDOW 0 0 56 VBottom 2
WINDOW 3 32 56 VTop 2
SYMATTR InstName R47
SYMATTR Value {Rg}
SYMBOL pmos 1648 -1296 M180
SYMATTR InstName M7
SYMATTR Value RRR030P03
SYMBOL res 3440 -3120 R0
SYMATTR InstName R48
SYMATTR Value 4.7
SYMBOL cap 3728 -2944 R90
WINDOW 0 0 32 VBottom 2
WINDOW 3 32 32 VTop 2
SYMATTR InstName C1
SYMATTR Value 10p
SYMBOL cap 3760 -3328 R90
WINDOW 0 0 32 VBottom 2
WINDOW 3 32 32 VTop 2
SYMATTR InstName C3
SYMATTR Value 4.7n
SYMBOL res 4512 -3120 R0
SYMATTR InstName R50
SYMATTR Value 10
SYMBOL res 2320 -3120 R0
SYMATTR InstName R51
SYMATTR Value 10
SYMBOL res 1312 -3120 R0
SYMATTR InstName R52
SYMATTR Value 10
SYMBOL cap 2640 -3328 R90
WINDOW 0 0 32 VBottom 2
WINDOW 3 32 32 VTop 2
SYMATTR InstName C2
SYMATTR Value 1n
SYMBOL cap 1616 -3328 R90
WINDOW 0 0 32 VBottom 2
WINDOW 3 32 32 VTop 2
SYMATTR InstName C4
SYMATTR Value 1n
SYMBOL cap 4832 -3328 R90
WINDOW 0 0 32 VBottom 2
WINDOW 3 32 32 VTop 2
SYMATTR InstName C5
SYMATTR Value 1n
SYMBOL cap 1616 -2912 R90
WINDOW 0 0 32 VBottom 2
WINDOW 3 32 32 VTop 2
SYMATTR InstName C6
SYMATTR Value 10p
SYMBOL npn -1184 832 R0
SYMATTR InstName Q22
SYMATTR Value 2N3904
SYMBOL schottky -1216 800 R270
WINDOW 0 32 32 VTop 2
WINDOW 3 0 32 VBottom 2
SYMATTR InstName D5
SYMATTR Value BAT54
SYMATTR Description Diode
SYMATTR Type diode
SYMBOL npn -1472 576 R0
SYMATTR InstName Q23
SYMATTR Value 2N3904
SYMBOL res -1136 464 R0
SYMATTR InstName R7
SYMATTR Value 100
SYMBOL res -1424 704 R0
SYMATTR InstName R32
SYMATTR Value 220
SYMBOL res -1424 928 R0
SYMATTR InstName R33
SYMATTR Value 220
SYMBOL res -1616 432 R270
WINDOW 0 32 56 VTop 2
WINDOW 3 0 56 VBottom 2
SYMATTR InstName R34
SYMATTR Value 1m
SYMBOL npn -2000 832 R0
SYMATTR InstName Q24
SYMATTR Value 2N3904
SYMBOL schottky -2032 800 R270
WINDOW 0 32 32 VTop 2
WINDOW 3 0 32 VBottom 2
SYMATTR InstName D21
SYMATTR Value BAT54
SYMATTR Description Diode
SYMATTR Type diode
SYMBOL npn -2288 576 R0
SYMATTR InstName Q25
SYMATTR Value 2N3904
SYMBOL res -1952 464 R0
SYMATTR InstName R35
SYMATTR Value 100
SYMBOL res -2240 704 R0
SYMATTR InstName R36
SYMATTR Value 220
SYMBOL res -2240 928 R0
SYMATTR InstName R37
SYMATTR Value 220
SYMBOL res -2432 432 R270
WINDOW 0 32 56 VTop 2
WINDOW 3 0 56 VBottom 2
SYMATTR InstName R38
SYMATTR Value 1m
SYMBOL res 3824 -2128 R0
SYMATTR InstName R39
SYMATTR Value 2
TEXT -640 -3848 Left 2 !.lib ../../spice_models/tip42c.bjt
TEXT -640 -3880 Left 2 !.lib ../../spice_models/tip41c.bjt
TEXT -448 -1464 Left 2 !.step temp 0 50 25
TEXT -448 -1496 Left 2 ;.op
TEXT -448 -1432 Left 2 !;.step param V_HIGH 18 25 1
TEXT -640 -3664 Left 2 !.param beta=3468
TEXT -640 -3696 Left 2 !;.step param beta 3100 4000 100
TEXT -640 -3632 Left 2 ;{300*exp(beta*(1/(TEMP+273.15)-1/(25+273.15)))}
TEXT 152 -3712 Left 2 !.param L_FERRITE=1p
TEXT 152 -3744 Left 2 !.param R_X=25 R_Y=19 R_INH=15
TEXT 1424 -3656 Left 2 !.param R_ISENSE_INH=0.365
TEXT 72 -1528 Left 2 !;.step param R_TRIM 4.1k 4.2k 20
TEXT 80 -1488 Left 2 !.param R_TRIM=3.95k
TEXT -448 -1400 Left 2 !.param V_HIGH 20
TEXT -448 -1368 Left 2 !;.param temp 25
TEXT 128 -3800 Left 2 !.model LDSW SW(Ron=1m Roff=1Meg Vt=.5 Vh=-.4)
TEXT -448 -1528 Left 2 ;.tran 10u
TEXT 2784 -1856 Left 2 !K2 L_LOAD3 L_LOAD4 1
TEXT 3840 -984 Left 2 !K3 L_LOAD5 L_LOAD6 1
TEXT 4976 -1856 Left 2 !K4 L_LOAD7 L_LOAD8 1
TEXT 3392 -3584 Left 2 !.param R_ISENSE_XY=0.34
TEXT -448 -1240 Left 2 !.tran {TC*10} uic
TEXT -448 -1304 Left 2 !.param TON=300n
TEXT -448 -1272 Left 2 !.param TC=500n
TEXT 3136 -1304 Left 2 !.param Rg=1m
TEXT 3056 -1256 Left 2 !;.step param Rg 10 100 10
TEXT -448 -1336 Left 2 ;.dc V_RD 0 3.3 0.01
TEXT 3136 -1336 Left 2 !.param Rout=33
TEXT -680 -592 Left 2 ;PULSE(0 3.3 {TC/2} 1n 1n {TON} {TC})
TEXT -528 -848 Left 2 ;PULSE(0 3.3 50n 1n 1n {TON} {TC} 1000)
TEXT 320 -176 Left 7 ;What we probably want is the DMC3350LDW for the FETs.\nActually, we probably want the SSM6L40TU from Toshiba instead.
TEXT -640 -3816 Left 2 !.lib ../../spice_models/ssm6l40tu_n.lib
TEXT -640 -3784 Left 2 !.lib ../../spice_models/ssm6l40tu_p.lib
TEXT 2800 -456 Left 2 ;See https://fscdn.rohm.com/en/products/databook/applinote/common/how_to_use_ltspice_models_an-e.pdf\non how to use .subck models in FETs and other primitives.
TEXT 1736 -896 Left 2 !K1 L_LOAD1 L_LOAD2 1
TEXT 384 -472 Left 2 ;See https://fscdn.rohm.com/en/products/databook/applinote/common/how_to_use_ltspice_models_an-e.pdf\non how to use .subck models in FETs and other primitives.
TEXT -448 -1208 Left 2 !.param TDELAY = {TC-TON}
TEXT -640 -3752 Left 2 !.lib ../../spice_models/2db1182q.bjt
CIRCLE Normal -80 -3280 -256 -3392 2

The netlist it stands for:
* line_switch_new3.asc
R8 DB N030 {R_TRIM}
R9 N002 N004 {R_ISENSE_INH}
Q5 N012 N011 N004 0 2DB1182Q
Q8 0 DB N020 0 2N3906
Q9 DB DB N019 0 2N3906
R10 N001 VT 145
R11 VT N018 145
RT N001 VT {300*exp(beta*(1/(TEMP+273.15)-1/(25+273.15)))}
D2 N012 N011 BAT54SHY
D6 N029 N001 BZX84C6V2L
R15 N033 0 4.7k
Q10 0 N033 N030 0 2N3906
Q11 N033 N033 N029 0 2N3906
R1 N002 N006 {R_ISENSE_INH}
Q1 N013 N005 N006 0 2DB1182Q
Q2 0 N021 N023 0 2N3906
D1 N013 N005 BAT54SHY
S1 N013 N013 N016 0 LDSW
V1 N016 0 PULSE(1 0 150n 1n 1n 150n 500n 10)
R_LOAD1 N013 N027 {R_INH}
L_LOAD3 N031 N027 {L_FERRITE*8192}
L_LOAD4 N031 0 {L_FERRITE*8192}
Q3 N001 N020 N021 0 2N3904
Q6 0 N021 N022 0 2N3906
R4 N021 0 1k
Q13 N019 N019 N018 0 2DB1182Q
R5 N020 N001 200
R6 N002 N008 {R_ISENSE_XY}
Q4 N014 N007 N008 0 2DB1182Q
Q7 0 N021 N024 0 2N3906
D3 N014 N007 BAT54SHY
R_LOAD2 LEFT N041 {R_X}
L_LOAD5 N042 N041 {L_FERRITE*128*16}
L_LOAD6 N042 RIGHT {L_FERRITE*128*16}
R12 N002 N010 {R_ISENSE_XY}
Q12 N015 N009 N010 0 2DB1182Q
Q14 0 N021 N025 0 2N3906
D4 N015 N009 BAT54SHY
S4 N026 N015 N017 0 LDSW
V5 N017 0 PULSE(1 0 350n 1n 1n 150n 500n 10)
R_LOAD3 N026 N028 {R_Y}
L_LOAD7 N032 N028 {L_FERRITE*128*16}
L_LOAD8 N032 0 {L_FERRITE*128*16}
R2 V_HIGH N002 0.1m
R3 V_HIGH N001 0.1m
V6 V_HIGH 0 {V_HIGH}
D7 N038 LEFT 1N914
D8 LEFT N045 1N914
D9 N039 RIGHT 1N914
D10 RIGHT Dbr 1N914
D11 0 RIGHT BZX84C27VLY
D12 0 LEFT BZX84C27VLY
V_WR WR 0 PULSE(3.3 0 {TC/2+TDELAY/4} 1n 1n {TON} {TC} 1000)
V_RD RD 0 PULSE(3.3 0 {TDELAY/4} 1n 1n {TON} {TC})
V_EN EN 0 3.3
V_LOGIC V_LOGIC 0 3.3
R13 Gtl TL {Rg}
R14 BR Gbr {Rg}
R16 TR Gtr {Rg}
R17 Gbl BL {Rg}
R18 N034 CS0 1m
Q28 TL A N068 0 2N3904
R74 N053 TL 66
R75 N068 0 33
Q55 A N065 0 0 2N3904
D36 N065 A BAT54
Q56 N052 B N060 0 2N3904
R76 N052 A 100
R77 N060 N065 220
R96 N065 0 220
Q57 B N083 0 0 2N3904
D37 N083 B BAT54
Q72 N071 WR N080 0 2N3904
R97 N071 B 100
R98 N080 N083 220
R99 N083 0 220
R100 N072 N076 200
R101 N088 0 10
R102 N075 B 100
Q73 N076 N075 N088 0 2N3904
D38 N075 N076 BAT54
D39 0 N078 BZX84C8V2L
R103 BR 0 50
Q74 N072 N078 N084 0 2N3904
R104 N078 N076 100
D40 N084 N086 1N914
D41 N086 BR 1N914
R105 V_HIGH N072 1m
R106 V_LOGIC N071 1m
R107 V_LOGIC N052 1m
R108 V_HIGH N053 1m
Q15 TR C N067 0 2N3904
R19 N051 TR 66
R20 N067 0 33
Q16 C N064 0 0 2N3904
D13 N064 C BAT54
Q17 N050 D N059 0 2N3904
R21 N050 C 100
R22 N059 N064 220
R23 N064 0 220
Q18 D N081 0 0 2N3904
D14 N081 D BAT54
Q19 N069 RD N079 0 2N3904
R24 N069 D 100
R25 N079 N081 220
R26 N081 0 220
R27 N070 N074 200
R28 N087 0 10
R29 N073 D 100
Q20 N074 N073 N087 0 2N3904
D15 N073 N074 BAT54
D16 0 N077 BZX84C8V2L
R30 BL 0 50
Q21 N070 N077 N082 0 2N3904
R31 N077 N074 100
D17 N082 N085 1N914
D18 N085 BL 1N914
R63 V_HIGH N070 1m
R64 V_LOGIC N069 1m
R65 V_LOGIC N050 1m
R109 V_HIGH N051 1m
R_LOAD5 N037 N040 {R_INH}
L_LOAD1 N043 N040 {L_FERRITE*8192}
L_LOAD2 N043 N044 {L_FERRITE*8192}
M5 N039 Gtr CS0 CS0 RRR030P03
M1 N038 Gtl CS0 CS0 RRR030P03
M2 N045 Gbl 0 0 RTR025N03
M3 Dbr Gbr 0 0 RTR025N03
V_WR1 INH 0 PULSE(0 3.3 {TC/2+50n} 1n 1n {TON} {TC} 1000)
Q26 INH_DRV _INH N066 0 2N3904
R40 N049 INH_DRV 66
R41 N066 0 33
Q27 _INH N063 0 0 2N3904
D19 N063 _INH BAT54
Q29 N048 N055 N058 0 2N3904
R42 N048 _INH 100
R43 N058 N063 220
R44 N063 0 220
R45 V_LOGIC N048 1m
R46 V_HIGH N049 1m
D20 N036 N037 1N914
D23 N044 0 1N914
D25 0 N037 BZX84C27VLY
R47 N035 INH_DRV {Rg}
M7 N036 N035 N012 N012 RRR030P03
R48 N007 N024 4.7
C1 N014 N007 10p
C3 N008 N007 4.7n
R50 N009 N025 10
R51 N005 N023 10
R52 N011 N022 10
C2 N006 N005 1n
C4 N004 N003 1n
C5 N010 N009 1n
C6 N012 N011 10p
Q22 N055 N062 0 0 2N3904
D5 N062 N055 BAT54
Q23 N047 N054 N057 0 2N3904
R7 N047 N055 100
R32 N057 N062 220
R33 N062 0 220
R34 V_LOGIC N047 1m
Q24 N054 N061 0 0 2N3904
D21 N061 N054 BAT54
Q25 N046 INH N056 0 2N3904
R35 N046 N054 100
R36 N056 N061 220
R37 N061 0 220
R38 V_LOGIC N046 1m
R39 N014 N034 2
.model D D
.lib standard.dio
.model NPN NPN
.model PNP PNP
.lib standard.bjt
.model NMOS NMOS
.model PMOS PMOS
.lib standard.mos
.lib ../../spice_models/tip42c.bjt
.lib ../../spice_models/tip41c.bjt
.step temp 0 50 25
* .op
;.step param V_HIGH 18 25 1
.param beta=3468
;.step param beta 3100 4000 100
* {300*exp(beta*(1/(TEMP+273.15)-1/(25+273.15)))}
.param L_FERRITE=1p
.param R_X=25 R_Y=19 R_INH=15
.param R_ISENSE_INH=0.365
;.step param R_TRIM 4.1k 4.2k 20
.param R_TRIM=3.95k
.param V_HIGH 20
;.param temp 25
.model LDSW SW(Ron=1m Roff=1Meg Vt=.5 Vh=-.4)
* .tran 10u
K2 L_LOAD3 L_LOAD4 1
K3 L_LOAD5 L_LOAD6 1
K4 L_LOAD7 L_LOAD8 1
.param R_ISENSE_XY=0.34
.tran {TC*10} uic
.param TON=300n
.param TC=500n
.param Rg=1m
;.step param Rg 10 100 10
* .dc V_RD 0 3.3 0.01
.param Rout=33
* PULSE(0 3.3 {TC/2} 1n 1n {TON} {TC})
* PULSE(0 3.3 50n 1n 1n {TON} {TC} 1000)
* What we probably want is the DMC3350LDW for the FETs.
* Actually, we probably want the SSM6L40TU from Toshiba instead.
.lib ../../spice_models/ssm6l40tu_n.lib
.lib ../../spice_models/ssm6l40tu_p.lib
* See https://fscdn.rohm.com/en/products/databook/applinote/common/how_to_use_ltspice_models_an-e.pdf
* on how to use .subck models in FETs and other primitives.
K1 L_LOAD1 L_LOAD2 1
* See https://fscdn.rohm.com/en/products/databook/applinote/common/how_to_use_ltspice_models_an-e.pdf
* on how to use .subck models in FETs and other primitives.
.param TDELAY = {TC-TON}
.lib ../../spice_models/2db1182q.bjt
.backanno
.end